# EAGLE schematic lm3410-boost-flashlight-driver-17mm-mk-1.1 (EAGLE 7.5.0)
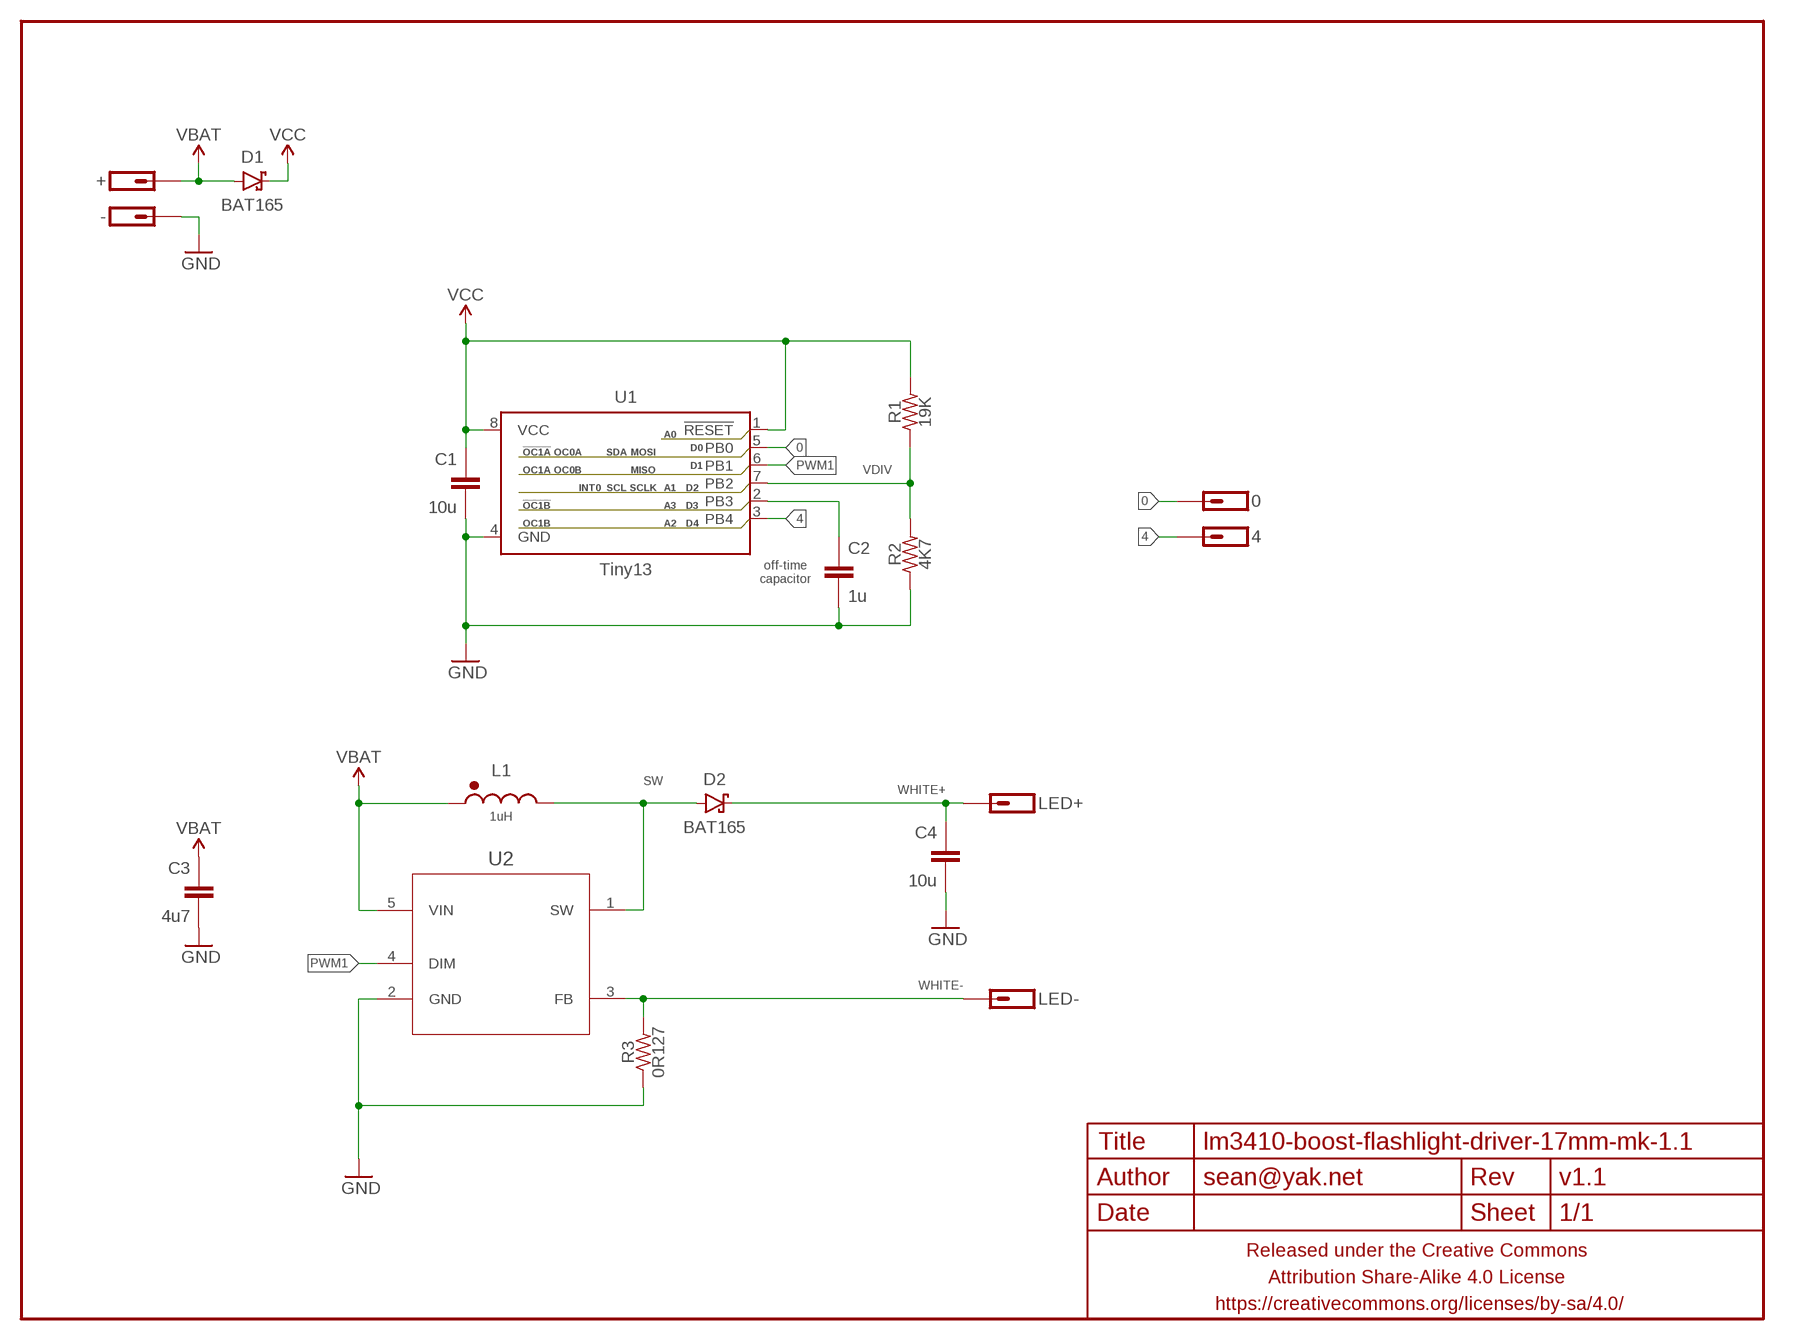
[diagram p0: schematic, sheet 1]

## Parts
0  M01SMD-1MM-DIA-NS  [1X01-SMD-1MM-DIA-NS]
4  M01SMD-1MM-DIA-NS  [1X01-SMD-1MM-DIA-NS]
+  M01PTH-1MM-CIR-NS  [1X01-1MM-CIR-NS]
-  M01NOT-A-VIA-NOPE  [1X01_NOSILK_NOSTOP]
C1  10u  CAPACITOR-CERAMICC0603-TIGHTER  [C0603-TIGHTER]
C2  1u  CAPACITOR-CERAMICC0603-TIGHTER  [C0603-TIGHTER]
C3  4u7  CAPACITOR-CERAMICC0603-TIGHTER  [C0603-TIGHTER]
C4  10u  CAPACITOR-CERAMICC0603-TIGHTER  [C0603-TIGHTER]
D1  BAT165  DIODE-SCHOTTKYSOD323  [SOD323-SCHOTTKY]
D2  BAT165  DIODE-SCHOTTKYSOD323  [SOD323-SCHOTTKY]
FRAME1  FRAME-LETTERNO_PACKAGE  [DUMMY]
L1  1uH  INDUCTORPFL2512  [PFL2512]
LED+  M01PTH-1.2MM-NS  [1X01-1.2MM-NS]
LED-  M01PTH-1.2MM-NS  [1X01-1.2MM-NS]
R1  19K  RESISTORR0603-TIGHTER  [R0603-TIGHTER]
R2  4K7  RESISTORR0603-TIGHTER  [R0603-TIGHTER]
R3  0R127  RESISTORR0805  [R0805]
U1  Tiny13  ATTINY13SOIC-NARROWPADS  [SO08-NARROWER]
U2  LM3410XMF  [SOT95P285X120-5N]

## Nets
0: 0.P$1 U1.5(PB0)
4: 4.P$1 U1.3(PB4)
GND: -.P$1 C1.2 C2.2 C3.2 C4.2 R2.1 R3.1 U1.4(GND) U2.2(GND)
N$2: C2.1 U1.2(PB3)
PWM1: U1.6(PB1) U2.4(DIM)
SW: D2.A L1.P$2 U2.1(SW)
VBAT: +.1 C3.1 D1.A L1.P$1 U2.5(VIN)
VCC: C1.1 D1.C R1.2 U1.1(!RESET) U1.8(VCC)
VDIV: R1.1 R2.2 U1.7(PB2)
WHITE+: C4.1 D2.C LED+.P$1
WHITE-: LED-.P$1 R3.2 U2.3(FB)

## Notes on the sheet
- off-time
  capacitor

## Library data of the parts
0 4 + - LED+ LED- = a_parts:M01: Header 1 Standard 1-pin 0.1" header. Use with straight break away headers (SKU : PRT-00116), right angle break away headers (PRT-00553), swiss pins (PRT-00743), machine pins (PRT-00117), and female headers (PRT-00115).
C1-C4 = a_parts:CAPACITOR-CERAMIC: CAPACITOR, European symbol
D1 D2 = a_parts:DIODE-SCHOTTKY: Schottky diodes in SFE's production catalog BAT20J 1A 23V 0.62Vf RB751 120mA 40V 0.37Vf PMEG4005EJ 0.5A 40V 0.42Vf MBRA140 1A 40V 0.5Vf B340A 3A 40V SMA
FRAME1 = a_parts:FRAME-LETTER: Schematic Frame Standard 8.5x11 US Letter frame; DESIGNER: sean@yak.net; VERSION: v1.1
L1 = a_parts:INDUCTOR: Inductors Basic Inductor/Choke - 0603 and 1206. Footprints are not proven and vary greatly between part numbers. SRN6045- 33uH, 20% 1.4A SDR0403-560KL - 56uH, 10%, 500mA RMS/740mA peak
R1-R3 = a_parts:RESISTOR: RESISTOR, American symbol
U1 = a_parts:ATTINY13: Atmel 8-pin 1kB flash uC
U2 = a_parts:LM3410XMF: Constant Current Boost and SEPIC LED Driver; MPN: LM3410XMF; OC_FARNELL: 1685357; OC_NEWARK: 75M6032; PACKAGE: SOT-5; SUPPLIER: National Semiconductor